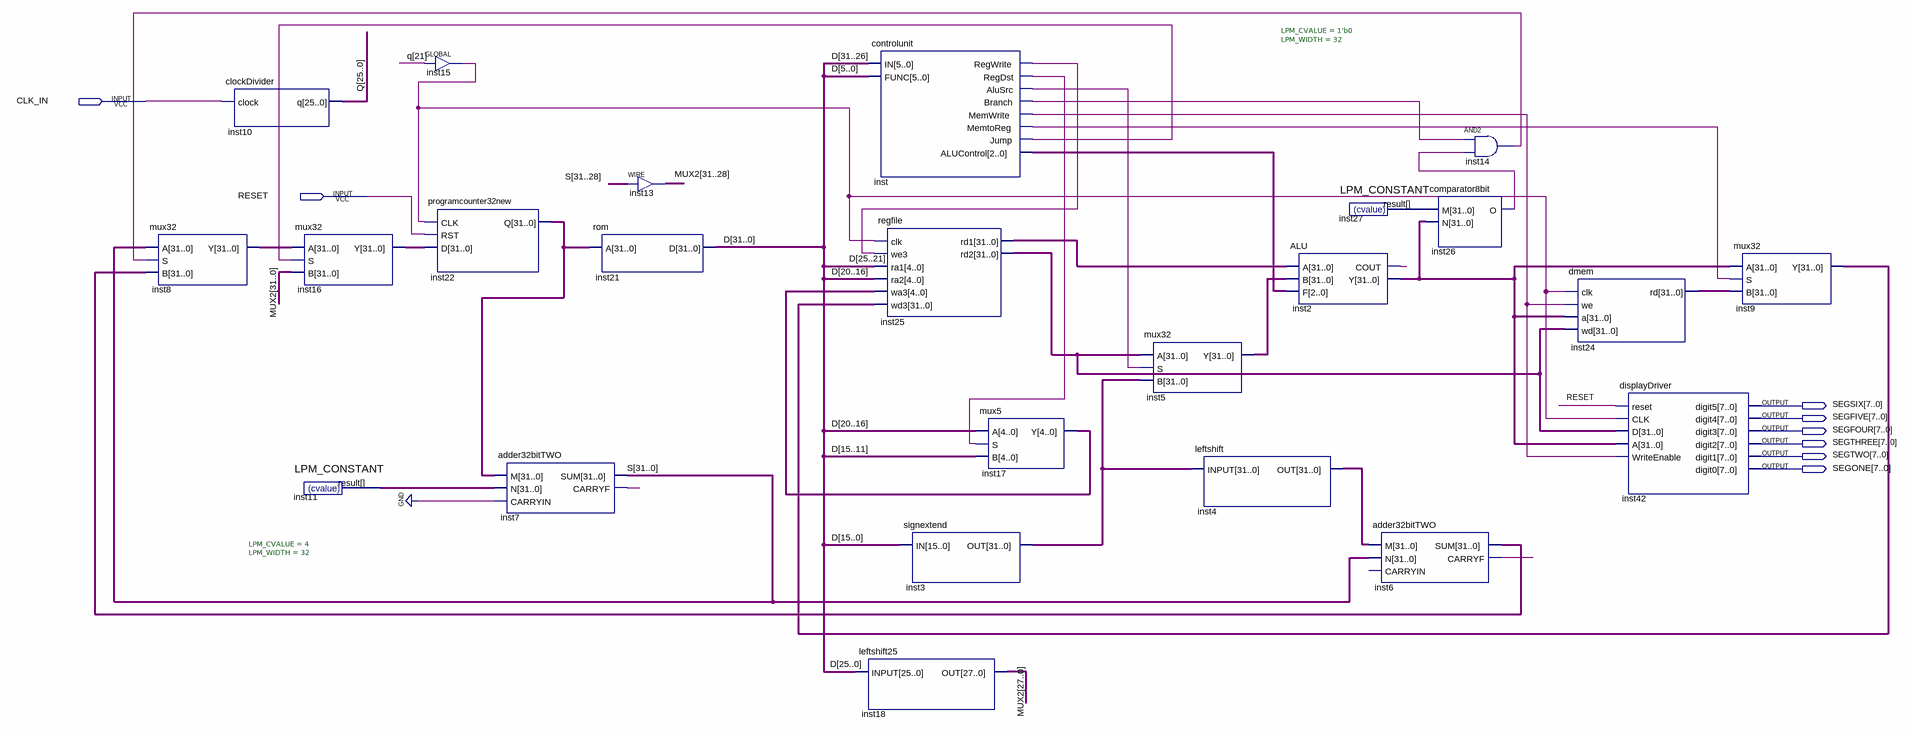
[diagram p0: schematic sheet]
// Quartus schematic processor.bdf as structural Verilog: 24 symbols, 8 pins
module processor (
  input  CLK_IN,
  input  RESET,
  output [7:0] SEGSIX,
  output [7:0] SEGFIVE,
  output [7:0] SEGFOUR,
  output [7:0] SEGTHREE,
  output [7:0] SEGTWO,
  output [7:0] SEGONE
);

  wire inst2_cout, inst6_carryf, inst7_carryf, inst14_out, inst15_out, inst26_o, inst_alusrc, inst_branch,
       inst_jump, inst_memtoreg, inst_memwrite, inst_regdst, inst_regwrite;
  wire [2:0] inst_alucontrol;
  wire [4:0] inst17_y;
  wire [25:0] Q;
  wire [31:0] D, inst2_y, inst3_out, inst4_out, inst5_y, inst6_sum, inst8_y, inst9_y, inst11_result,
       inst16_y, inst22_q, inst24_rd, inst25_rd1, inst25_rd2, inst27_result, MUX2, S;

  mux32 inst8 (.A(S), .S(inst14_out), .B(inst6_sum), .Y(inst8_y));
  clockDivider inst10 (.clock(CLK_IN), .q(Q));
  mux32 inst16 (.A(inst8_y), .S(inst_jump), .B(MUX2), .Y(inst16_y));
  LPM_CONSTANT #(.LPM_CVALUE(4), .LPM_WIDTH(32)) inst11 (.result(inst11_result));
  GLOBAL inst15 (.IN(Q[21]), .OUT(inst15_out));
  programcounter32new inst22 (.CLK(inst15_out), .RST(RESET), .D(inst16_y), .Q(inst22_q));
  adder32bitTWO inst7 (.M(inst22_q), .N(inst11_result), .CARRYIN(1'b0), .SUM(S), .CARRYF(inst7_carryf));
  rom inst21 (.A(inst22_q), .D(D));
  assign MUX2[31:28] = S[31:28];  // WIRE inst13
  controlunit inst (
    .IN(D[31:26]), .FUNC(D[5:0]), .RegWrite(inst_regwrite), .RegDst(inst_regdst), .AluSrc(inst_alusrc),
    .Branch(inst_branch), .MemWrite(inst_memwrite), .MemtoReg(inst_memtoreg), .Jump(inst_jump),
    .ALUControl(inst_alucontrol));
  regfile inst25 (
    .clk(inst15_out), .we3(inst_regwrite), .ra1(D[25:21]), .ra2(D[20:16]), .wa3(inst17_y), .wd3(inst9_y),
    .rd1(inst25_rd1), .rd2(inst25_rd2));
  leftshift25 inst18 (.INPUT(D[25:0]), .OUT(MUX2[27:0]));
  signextend inst3 (.IN(D[15:0]), .OUT(inst3_out));
  mux5 inst17 (.A(D[20:16]), .S(inst_regdst), .B(D[15:11]), .Y(inst17_y));
  mux32 inst5 (.A(inst25_rd2), .S(inst_alusrc), .B(inst3_out), .Y(inst5_y));
  leftshift inst4 (.INPUT(inst3_out), .OUT(inst4_out));
  ALU inst2 (.A(inst25_rd1), .B(inst5_y), .F(inst_alucontrol), .COUT(inst2_cout), .Y(inst2_y));
  LPM_CONSTANT #(.LPM_CVALUE(1'b0), .LPM_WIDTH(32)) inst27 (.result(inst27_result));
  adder32bitTWO inst6 (.M(inst4_out), .N(S), .SUM(inst6_sum), .CARRYF(inst6_carryf));  // open: CARRYIN
  comparator8bit inst26 (.M(inst27_result), .N(inst2_y), .O(inst26_o));
  and inst14 (inst14_out, inst_branch, inst26_o);
  dmem inst24 (.clk(inst15_out), .we(inst_memwrite), .a(inst2_y), .wd(inst25_rd2), .rd(inst24_rd));
  displayDriver inst42 (
    .reset(RESET), .CLK(inst15_out), .D(inst25_rd2), .A(inst2_y), .WriteEnable(inst_memwrite),
    .digit5(SEGSIX), .digit4(SEGFIVE), .digit3(SEGFOUR), .digit2(SEGTHREE), .digit1(SEGTWO), .digit0(SEGONE));
  mux32 inst9 (.A(inst2_y), .S(inst_memtoreg), .B(inst24_rd), .Y(inst9_y));
endmodule
